# Altium project pca10112.PrjPCB (part 5 of 5)

## Sheet pca10112_sheet8_FEM.SchDoc: PCA10112 - Front End Module
size A3; Organization: Nordic Semiconductor; DocumentNumber: 8; Revision: 1.1.0; SheetNumber: 8; SheetTotal: 8; Author: HANY; CompanyName: Nordic Semiconductor; DrawnBy: HANY; ProjectName: pca10112.PrjPCB
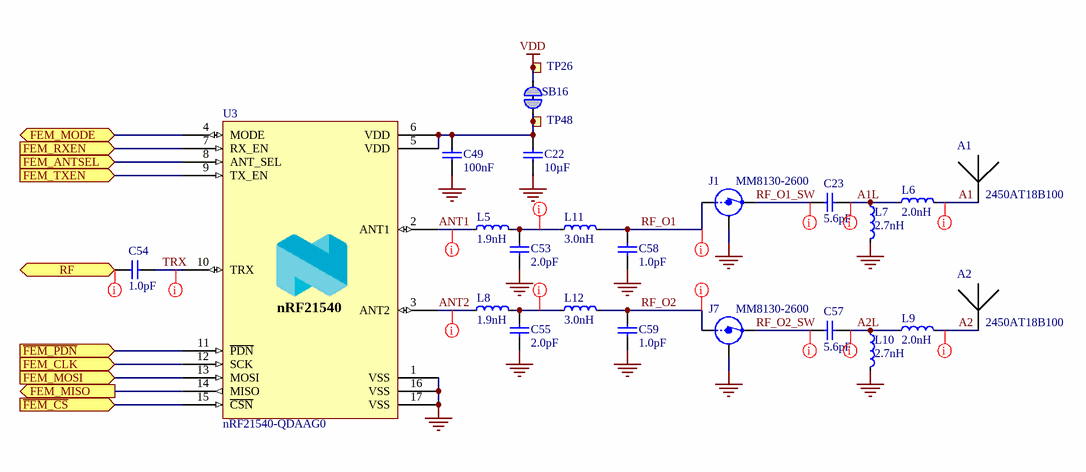
[diagram p7: pca10112_sheet8_FEM.SchDoc]

### Parts
A1  2450AT18B100  [2450AT18B100]
A2  2450AT18B100  [2450AT18B100]
C22  10µF  [CAPC1608X06L]
C23  5.6pF  [CAPC0603X03L_C]
C49  100nF  [CAPC0603X03L_C]
C53  2.0pF  [CAPC0603X03L_C]
C54  1.0pF  [CAPC0603X03L_C]
C55  2.0pF  [CAPC0603X03L_C]
C57  5.6pF  [CAPC0603X03L_C]
C58  1.0pF  [CAPC0603X03L_C]
C59  1.0pF  [CAPC0603X03L_C]
J1  MM8130-2600  [COAXIAL-SWF]
J7  MM8130-2600  [COAXIAL-SWF]
L5  1.9nH  [INDC0603X03L_C]
L6  2.0nH  [INDC0603X03L_C]
L7  2.7nH  [INDC0603X03L_C]
L8  1.9nH  [INDC0603X03L_C]
L9  2.0nH  [INDC0603X03L_C]
L10  2.7nH  [INDC0603X03L_C]
L11  3.0nH  [INDC0603X03L_C]
L12  3.0nH  [INDC0603X03L_C]
SB16  Solderbridge  [Solderbridge_Shorted]  (value not drawn)  (net tie, no BOM)
TP26  Ø1.0mm,SMD  [TP_SMD_Ø1.0mm]  (value not drawn)  (no BOM)
TP48  Ø1.0mm,SMD  [TP_SMD_Ø1.0mm]  (value not drawn)  (no BOM)
U3  nRF21540-QDAAG0  [QFN65P400X400X65_HS-17N]

### Ports
FEM_ANTSEL (in), FEM_CLK (in), FEM_MISO (out), FEM_MODE (bidir), FEM_MOSI (in), FEM_RXEN (in), FEM_TXEN (in), RF (bidir), ~{FEM_CS} (in), ~{FEM_PDN} (in)

### Nets
GND: C22.1 C49.1 C53.1 C55.1 C58.1 C59.1 J1.2(Shield) J7.2(Shield) L7.2 L10.2 U3.1(VSS) U3.16(VSS) U3.17(VSS)
VDD: SB16.1 TP26.1
A1: A1.1 L6.2
A1L: C23.1 L6.1 L7.1
A2: A2.1 L9.2
A2L: C57.1 L9.1 L10.1
ANT1: L5.1 U3.2(ANT1)
ANT2: L8.1 U3.3(ANT2)
P0.17: U3.4(MODE) ; port FEM_MODE
P0.19: U3.7(RX_EN) ; port FEM_RXEN
P0.20: U3.8(ANT_SEL) ; port FEM_ANTSEL
P0.21: U3.15(~{CSN}) ; port ~{FEM_CS}
P0.22: U3.9(TX_EN) ; port FEM_TXEN
P0.23: U3.11(~{PDN}) ; port ~{FEM_PDN}
P1.13: U3.13(MOSI) ; port FEM_MOSI
P1.14: U3.14(MISO) ; port FEM_MISO
P1.15: U3.12(SCK) ; port FEM_CLK
RF: C54.1 ; port RF
RF_O1: C58.2 J1.1(IN) L11.2
RF_O1_SW: C23.2 J1.3(OUT)
RF_O2: C59.2 J7.1(IN) L12.2
RF_O2_SW: C57.2 J7.3(OUT)
TRX: C54.2 U3.10(TRX)
NetC22_2: C22.2 C49.2 SB16.2 TP48.1 U3.5(VDD) U3.6(VDD)
NetC53_2: C53.2 L5.2 L11.1
NetC55_2: C55.2 L8.2 L12.1

### Layout directives
net class Ant: A1, A1L, A2, A2L, ANT1, ANT2, NetC53_2, NetC55_2, RF, RF_O1, RF_O1_SW, RF_O2, RF_O2_SW, TRX

### Notes on the sheet
- Size
- Date:
- A3
- Project Number
- Sheet         of
- Revision
- File:
- Drawn By:
- (in symbol nRF21540-QDAAG0) nRF21540

### Library data of the parts
A1 A2 = Johanson 2450AT18B100: 2.45 GHz chip antenna; Manufacturer: Johanson Technology; Part number IPS: 00000007781; Note: N.A.; Pad Count: 2; Part Number: Johanson 2450AT18B100; Manufacturer Part Number: 2450AT18B100; Footprint Doc: 2450AT18B100; LatestRevisionDate: 2013-09-13; Pin Count: 2; Publisher: Nordic Semiconductor; Published: 2013-09-13; Value: 2450AT18B100; Artikkelnr Noca: N.A.; ComponentLink1URL: N.A.; ComponentLink1Description: Datasheet; ComponentLink2URL: N.A.; ComponentLink2Description: Supplier link; HelpURL: http://www.johansontechnology.com/datasheets/antennas/2450AT18B100.pdf; Supplier 1: Digi-Key; Supplier Part Number 1: 712-1006-1-ND; Supplier 2: N.A.; Supplier Part Number 2: N.A.; Component Class: Antennas; PartId: 100700001; Author: rsk; Part number Norautron: N.A.
C22 = C0603-10µ: Capacitor, X5R, ±20%; Manufacturer: N.A.; Part number IPS: 00000007785; Note: 6.3V; Artikkelnr Noca: 20039234; Pad Count: 2; Part Number: C0603-10µ; Manufacturer Part Number: N.A.; ComponentLink1URL: N.A.; ComponentLink1Description: Datasheet; ComponentLink2URL: N.A.; ComponentLink2Description: Supplier link; HelpURL: N.A.; Footprint Doc: 0603; LatestRevisionDate: 2011-01-17; Pin Count: 2; Publisher: Nordic Semiconductor; Published: 2011-01-17; Value: 10µF; Supplier 1: N.A.; Supplier Part Number 1: N.A.; Supplier 2: N.A.; Supplier Part Number 2: N.A.; Component Class: Capacitors; PartId: 100200275; Author: rsk; Part number Norautron: N.A.
C23 C57 = C0201-5.6p: Chip Cap 0201; Manufacturer: N.A.; Part number IPS: 00000004899; Note: Chip Cap 1%; Pad Count: 2; Part Number: C0201-5.6p; Manufacturer Part Number: N.A.; LatestRevisionDate: 2020-10-13; Pin Count: 2; Publisher: Nordic Semiconductor; Published: 2014-11-13; Value: 5.6pF; Artikkelnr Noca: N.A.; Footprint Doc: 0201; ComponentLink1URL: N.A.; ComponentLink1Description: Datasheet; ComponentLink2URL: N.A.; ComponentLink2Description: Supplier link; HelpURL: N.A.; Supplier 1: N.A.; Supplier Part Number 1: N.A.; Supplier 2: N.A.; Supplier Part Number 2: N.A.; Component Class: Capacitors; PartId: 100200028; Author: rsk; Part number Norautron: N.A.
C49 = C0201-100n: Capacitor, X5R, ±10%; Manufacturer: N.A.; Part number IPS: 00000001248, 00000002505; Note: 16V; Pad Count: 2; Part Number: C0201-100n; Manufacturer Part Number: N.A.; ComponentLink1URL: N.A.; ComponentLink1Description: Datasheet; ComponentLink2URL: N.A.; ComponentLink2Description: Supplier link; HelpURL: N.A.; Footprint Doc: 0201; LatestRevisionDate: 2017-11-09; Pin Count: 2; Publisher: Nordic Semiconductor; Published: 2014-11-13; Value: 100nF; Artikkelnr Noca: N.A.; Supplier 1: N.A.; Supplier Part Number 1: N.A.; Supplier 2: N.A.; Supplier Part Number 2: N.A.; Component Class: Capacitors; PartId: 100200078; Author: rsk; Part number Norautron: N.A.
C53 C55 = C0201-2.0p-HQ-Murata: Capacitor, NP0, ±0.05pF, 25V; Manufacturer: Murata; Manufacturer Part Number: GJM0335C1E2R0WB01; Part number IPS: 00000001775; Artikkelnr Noca: N.A.; Pad Count: 2; Part Number: C0201-2.0p-HQ-Murata; ComponentLink1URL: N.A.; ComponentLink1Description: Datasheet; ComponentLink2URL: N.A.; ComponentLink2Description: Supplier link; HelpURL: https://psearch.en.murata.com/capacitor/product/GJM0335C1E2R0WB01%23.html; Footprint Doc: 0201; LatestRevisionDate: 2018-10-25; Published: 2018-10-25; Value: 2.0pF; Note: 25V; Supplier 1: N.A.; Supplier Part Number 1: N.A.; Supplier 2: N.A.; Supplier Part Number 2: N.A.; Component Class: Capacitors; PartId: 100200419; Author: rsk; Part number Norautron: N.A.
C54 = C0201-1p0: CAP CER 1PF 25V C0G/NP0 0201; Manufacturer: Murata; Manufacturer Part Number: GJM0335C1E1R0BB01D; Part number IPS: 00000007964; Note: ±0.1pF; Artikkelnr Noca: N.A.; Pad Count: 2; Part Number: C0201-1p0; ComponentLink1URL: N.A.; ComponentLink1Description: Datasheet; ComponentLink2Description: Supplier link; HelpURL: http://search.murata.co.jp/Ceramy/image/img/A01X/G101/ENG/GJM0335C1E1R0BB01-01.pdf; Footprint Doc: 0201; LatestRevisionDate: 2020-10-13; Pin Count: 2; Publisher: Nordic Semiconductor; Published: 2017-09-21; Value: 1.0pF; ComponentLink2URL: N.A.; Supplier 1: Digi-Key; Supplier Part Number 1: 490-11172-1-ND; Supplier 2: N.A.; Supplier Part Number 2: N.A.; Component Class: Capacitors; PartId: 100200398; Author: rsk; Part number Norautron: N.A.
C58 C59 = C0201-1.0p_RF: RF Chip Cap 0201; Manufacturer: N.A.; Note: High frequency chip capasitors ±5%, NP0; Pad Count: 2; Part Number: C0201-1.0p_RF; Manufacturer Part Number: N.A.; ComponentLink1URL: N.A.; ComponentLink1Description: Datasheet; ComponentLink2URL: N.A.; ComponentLink2Description: Supplier link; HelpURL: N.A.; Footprint Doc: 0201; LatestRevisionDate: 2016-04-22; Published: 2016-04-22; Value: 1.0pF; Artikkelnr Noca: N.A.; Part number IPS: N.A.; Supplier 1: N.A.; Supplier Part Number 1: N.A.; Supplier 2: N.A.; Supplier Part Number 2: N.A.; Component Class: Capacitors; PartId: 100200085; Author: rsk; Part number Norautron: N.A.
J1 J7 = MM8130-2600: Coaxial Connector with Switch; Manufacturer: Murata; Part number IPS: 00000009955; Note: N.A.; Artikkelnr Noca: 55029011; Pad Count: 3; Part Number: MM8130-2600; Manufacturer Part Number: MM8130-2600; LatestRevisionDate: 2014-04-24; Pin Count: 3; Publisher: Nordic Semiconductor; Published: 2014-04-24; Value: MM8130-2600; Footprint Doc: COAXIAL-SWF; ComponentLink1URL: N.A.; ComponentLink1Description: Datasheet; ComponentLink2URL: N.A.; ComponentLink2Description: Supplier link; HelpURL: http://www.murata.com/products/catalog/pdf/o33e.pdf; Supplier 1: Digi-Key; Supplier Part Number 1: 490-4981-1-ND; Supplier 2: Mouser; Supplier Part Number 2: 81-MM8130-2600RA2; Component Class: Connectors; PartId: 100500400; Author: rsk; Part number Norautron: N.A.
L5 L8 = L0201-1n9-HQ-Murata: Inductor, 600mA, ±0.1ｎH, 120mOhm; Manufacturer: Murata; Manufacturer Part Number: LQP03HQ1N9B02; Part number IPS: 00000004903; Note: -55°C ~ 125°C; Artikkelnr Noca: N.A.; Pad Count: 2; Part Number: L0201-1n9-HQ-Murata; ComponentLink1URL: https://search.murata.co.jp/Ceramy/image/img/P02/JELF243C-0021.pdf; ComponentLink1Description: Datasheet; ComponentLink2Description: Supplier link; HelpURL: https://psearch.en.murata.com/inductor/product/LQP03HQ1N9B02%23.html; Footprint Doc: 0201; LatestRevisionDate: 2018-10-23; Pin Count: 2; Publisher: Nordic Semiconductor; Published: 2018-10-23; Value: 1.9nH; ComponentLink2URL: N.A.; Supplier 1: Digi-Key; Supplier Part Number 1: 490-13889-1-ND; Supplier 2: N.A.; Supplier Part Number 2: N.A.; Component Class: Inductors; PartId: 100300206; Author: rsk; Part number Norautron: N.A.
L6 L9 = L0201-2n0-HQ-Murata: Inductor, 600mA, ±0.1ｎH, 120mOhm; Manufacturer: Murata; Manufacturer Part Number: LQP03HQ2N0B02; Part number IPS: 00000001670; Note: -55°C ~ 125°C; Artikkelnr Noca: N.A.; Pad Count: 2; Part Number: L0201-2n0-HQ-Murata; LatestRevisionDate: 2018-10-23; Pin Count: 2; Publisher: Nordic Semiconductor; Published: 2018-10-23; Value: 2.0nH; Footprint Doc: 0201; ComponentLink1Description: Datasheet; ComponentLink2Description: Supplier link; ComponentLink1URL: https://search.murata.co.jp/Ceramy/image/img/P02/JELF243C-0021.pdf; HelpURL: https://psearch.en.murata.com/inductor/product/LQP03HQ2N0B02%23.html; ComponentLink2URL: N.A.; Supplier 1: Digi-Key; Supplier Part Number 1: 490-13895-1-ND; Supplier 2: N.A.; Supplier Part Number 2: N.A.; Component Class: Inductors; PartId: 100300207; Author: rsk; Part number Norautron: N.A.
L7 L10 = L0201-2n7-HQ-Murata: Inductor, 600mA, ±0.1ｎH, 120mOhm; Manufacturer: Murata; Manufacturer Part Number: LQP03HQ2N7B02; Part number IPS: 00000001753; Note: -55°C ~ 125°C; Artikkelnr Noca: N.A.; Pad Count: 2; Part Number: L0201-2n7-HQ-Murata; LatestRevisionDate: 2018-10-23; Pin Count: 2; Publisher: Nordic Semiconductor; Published: 2018-10-23; Value: 2.7nH; Footprint Doc: 0201; ComponentLink1Description: Datasheet; ComponentLink2Description: Supplier link; ComponentLink1URL: https://search.murata.co.jp/Ceramy/image/img/P02/JELF243C-0021.pdf; HelpURL: https://psearch.en.murata.com/inductor/product/LQP03HQ2N7B02%23.html; ComponentLink2URL: N.A.; Supplier 1: Digi-Key; Supplier Part Number 1: 490-13909-1-ND; Supplier 2: N.A.; Supplier Part Number 2: N.A.; Component Class: Inductors; PartId: 100300214; Author: rsk; Part number Norautron: N.A.
L11 L12 = L0201-3n0-HQ-Murata: Inductor, 600mA, ±0.1ｎH, 120mOhm; Manufacturer: Murata; Manufacturer Part Number: LQP03HQ3N0B02; Note: -55°C ~ 125°C; Artikkelnr Noca: N.A.; Pad Count: 2; Part Number: L0201-3n0-HQ-Murata; ComponentLink1URL: https://search.murata.co.jp/Ceramy/image/img/P02/JELF243C-0021.pdf; ComponentLink1Description: Datasheet; ComponentLink2Description: Supplier link; HelpURL: https://psearch.en.murata.com/inductor/product/LQP03HQ3N0B02%23.html; Footprint Doc: 0201; LatestRevisionDate: 2018-10-23; Published: 2018-10-23; Value: 3.0nH; Part number IPS: N.A.; ComponentLink2URL: N.A.; Supplier 1: Digi-Key; Supplier Part Number 1: 490-13915-1-ND; Supplier 2: N.A.; Supplier Part Number 2: N.A.; Component Class: Inductors; PartId: 100300217; Author: rsk; Part number Norautron: N.A.
SB16 = Solderbridge Shorted: Shorted Solderbridge; Manufacturer: N.A.; Pad Count: 2; Part Number: Solderbridge Shorted; Manufacturer Part Number: N.A.; LatestRevisionDate: 2012-08-07; Pin Count: 2; Publisher: Nordic Semiconductor; Published: 2012-08-07; Value: Solderbridge; Note: N.A.; Artikkelnr Noca: N.A.; Footprint Doc: Solderbridge_Shorted; Part number IPS: N.A.; ComponentLink1URL: N.A.; ComponentLink1Description: Datasheet; ComponentLink2URL: N.A.; ComponentLink2Description: Supplier link; HelpURL: N.A.; Supplier 1: N.A.; Supplier Part Number 1: N.A.; Supplier 2: N.A.; Supplier Part Number 2: N.A.; Component Class: Connectors; PartId: 100500459; Author: rsk; Part number Norautron: N.A.
TP26 TP48 = TP_SMD_Ø1.0MM: 1.0mm circular SMD testpad; Manufacturer: Nordic Semiconductor; Manufacturer Part Number: N.A.; Pad Count: 1; Part Number: TP_SMD_Ø1.0MM; LatestRevisionDate: 2021-03-05; Pin Count: 1; Publisher: Nordic Semiconductor; Published: 2013-06-11; Value: Ø1.0mm,SMD; Note: N.A.; Artikkelnr Noca: N.A.; Footprint Doc: TP_SMD_Ø1.0mm; Part number IPS: N.A.; ComponentLink1URL: N.A.; ComponentLink1Description: Datasheet; ComponentLink2URL: N.A.; ComponentLink2Description: Supplier link; HelpURL: N.A.; Supplier 1: N.A.; Supplier Part Number 1: N.A.; Supplier 2: N.A.; Supplier Part Number 2: N.A.; Component Class: Connectors; PartId: 100500475; Author: rsk; Part number Norautron: N.A.
U3 = nRF21540-QDAAG0: Radio front-end / range extender for 2.4GHz; Manufacturer: Nordic Semiconductor; Artikkelnr Noca: N.A.; Pad Count: 16; Author: hany; Component Class: nRF_Devices; ComponentLink1Description: Datasheet; ComponentLink1URL: N.A.; ComponentLink2Description: Supplier link; ComponentLink2URL: N.A.; Footprint Doc: QFN-16; HelpURL: N.A.; LatestRevisionDate: 2021-03-24; Manufacturer Part Number: nRF21540-QDAAG0; Note: N.A.; Part number IPS: N.A.; Part number Norautron: N.A.; Published: 2021-03-24; Supplier 1: Nordic Semiconductor; Supplier 2: N.A.; Supplier Part Number 1: nRF21540-QDAAG0; Supplier Part Number 2: N.A.; Value: nRF21540-QDAAG0; Part Number: nRF21540-QDAAG0

## Nets that join several sheets
GND: pca10112_sheet2_nrf52840_mcu (27 pins), pca10112_sheet3_pin_map (C51.1 C52.2), pca10112_sheet4_interface_mcu (37 pins), pca10112_sheet5_misc (22 pins), pca10112_sheet6_connectors (85 pins), pca10112_sheet7_power_supply (44 pins), pca10112_sheet8_FEM (13 pins)
V5V: pca10112_sheet6_connectors (5 pins), pca10112_sheet7_power_supply (12 pins)
VBUS: pca10112_sheet5_misc (Q40.2 R40.1), pca10112_sheet6_connectors (C69.2 FB61.2 J4.5), pca10112_sheet7_power_supply (D80.2)
VBUS_nRF: pca10112_sheet2_nrf52840_mcu (C21.1 U1.AD2), pca10112_sheet7_power_supply (R98.2)
VBUS_nRF': pca10112_sheet6_connectors (C68.2 FB60.2), pca10112_sheet7_power_supply (5 pins)
VDD: pca10112_sheet5_misc (18 pins), pca10112_sheet6_connectors (R68.2 SB47.1 SB59.2), pca10112_sheet7_power_supply (8 pins), pca10112_sheet8_FEM (SB16.1 TP26.1)
VDD_HV: pca10112_sheet2_nrf52840_mcu (C19.1 U1.Y2), pca10112_sheet6_connectors (P20.10 P26.10), pca10112_sheet7_power_supply (P23.1 R91.2 SB41.1 TP25.1)
VDD_HV': pca10112_sheet6_connectors (P20.11 P26.11), pca10112_sheet7_power_supply (5 pins)
VDD_nRF: pca10112_sheet2_nrf52840_mcu (11 pins), pca10112_sheet6_connectors (P20.1 P26.1), pca10112_sheet7_power_supply (5 pins)
VDD_nRF': pca10112_sheet6_connectors (P20.2 P26.2 SB60.2), pca10112_sheet7_power_supply (P22.2 R90.1 SB40.2 SW9.3)
VDD_SAM: pca10112_sheet4_interface_mcu (24 pins), pca10112_sheet6_connectors (J4.1 R64.2 R65.2 R66.2), pca10112_sheet7_power_supply (SB37.1 TP35.1 U18.A1)
VDD_UTMI: pca10112_sheet4_interface_mcu (C28.2 SB49.2 U2.79), pca10112_sheet7_power_supply (SB48.1 U24.A1)
VIN3-5V: pca10112_sheet6_connectors (P20.9 P26.9), pca10112_sheet7_power_supply (D83.2)
VIO: pca10112_sheet6_connectors (9 pins), pca10112_sheet7_power_supply (SB38.1)
VIO_REF: pca10112_sheet6_connectors (P20.12 P26.12), pca10112_sheet7_power_supply (R99.2)
VLi-Ion: pca10112_sheet6_connectors (J6.2 P27.2 TP31.1), pca10112_sheet7_power_supply (D82.2 SW9.5)
D20: pca10112_sheet5_misc (R43.1), pca10112_sheet6_connectors (P6.7 P12.7 P17.14)
D21: pca10112_sheet5_misc (R45.1), pca10112_sheet6_connectors (P6.8 P12.8 P17.16)
D_N: pca10112_sheet2_nrf52840_mcu (U1.AD4), pca10112_sheet6_connectors (D60.2 J3.2 TP13.1)
D_P: pca10112_sheet2_nrf52840_mcu (U1.AD6), pca10112_sheet6_connectors (D60.3 J3.3 TP14.1)
DFSD_N: pca10112_sheet4_interface_mcu (U2.80), pca10112_sheet6_connectors (R60.1)
DFSD_P: pca10112_sheet4_interface_mcu (U2.81), pca10112_sheet6_connectors (R61.1)
DHSD_N: pca10112_sheet4_interface_mcu (U2.77), pca10112_sheet6_connectors (D61.2 J2.2 R60.2 TP10.1)
DHSD_P: pca10112_sheet4_interface_mcu (U2.76), pca10112_sheet6_connectors (D61.3 J2.3 R61.2 TP9.1)
EXT_GND_DETECT: pca10112_sheet4_interface_mcu (U2.67), pca10112_sheet6_connectors (P19.9)
EXT_RESET: pca10112_sheet4_interface_mcu (U2.68), pca10112_sheet6_connectors (P19.10)
EXT_SWDCLK: pca10112_sheet4_interface_mcu (U2.70), pca10112_sheet6_connectors (P19.4)
EXT_SWDIO: pca10112_sheet4_interface_mcu (U2.71), pca10112_sheet6_connectors (P19.2)
EXT_SWO: pca10112_sheet4_interface_mcu (U2.18), pca10112_sheet6_connectors (P19.6)
EXT_VTG: pca10112_sheet4_interface_mcu (Q21.4 R24.1), pca10112_sheet6_connectors (P19.1 SB47.2)
~{IF_OFF}: pca10112_sheet4_interface_mcu (Q20.2 Q21.2 U2.90), pca10112_sheet5_misc (6 pins), pca10112_sheet7_power_supply (U18.B2 U24.B2)
IMCU_BOOT: pca10112_sheet4_interface_mcu (SB65.1 U2.24), pca10112_sheet5_misc (SB46.2 U7.15)
IMCU_CTS: pca10112_sheet4_interface_mcu (U2.38), pca10112_sheet5_misc (TP1.1 U5.3)
IMCU_RESET: pca10112_sheet4_interface_mcu (U2.57), pca10112_sheet6_connectors (J4.10 R66.1)
IMCU_RTS: pca10112_sheet4_interface_mcu (U2.39), pca10112_sheet5_misc (TP3.1 U5.15)
IMCU_RxD: pca10112_sheet4_interface_mcu (U2.40), pca10112_sheet5_misc (TP2.1 U5.11)
IMCU_TCKS: pca10112_sheet4_interface_mcu (U2.56), pca10112_sheet6_connectors (J4.4 R65.1)
IMCU_TDIS: pca10112_sheet4_interface_mcu (U2.51), pca10112_sheet6_connectors (J4.8 R67.1)
IMCU_TDOS: pca10112_sheet4_interface_mcu (U2.54), pca10112_sheet6_connectors (J4.6)
IMCU_TMSS: pca10112_sheet4_interface_mcu (U2.55), pca10112_sheet6_connectors (J4.2 R64.1)
IMCU_TxD: pca10112_sheet4_interface_mcu (U2.41), pca10112_sheet5_misc (TP4.1 U5.7)
NFC1: pca10112_sheet5_misc (C46.1 R44.1), pca10112_sheet6_connectors (J5.2 TP17.1)
NFC2: pca10112_sheet5_misc (C47.2 R46.1), pca10112_sheet6_connectors (J5.4 TP18.1)
OB_RESET: pca10112_sheet4_interface_mcu (U2.27), pca10112_sheet5_misc (TP7.1 U6.7)
OB_SWDCLK: pca10112_sheet4_interface_mcu (R28.2 U2.5), pca10112_sheet5_misc (TP6.1 U6.3)
OB_SWDIO: pca10112_sheet4_interface_mcu (R29.2 U2.12), pca10112_sheet5_misc (TP5.1 U6.15)
OB_SWO: pca10112_sheet4_interface_mcu (U2.20), pca10112_sheet5_misc (TP8.1 U6.11)
P0.02/AIN0: pca10112_sheet2_nrf52840_mcu (U1.A12), pca10112_sheet6_connectors (P4.8 P10.8 P16.16)
P0.03/AIN1: pca10112_sheet2_nrf52840_mcu (U1.B13), pca10112_sheet6_connectors (P2.1 P8.1 P14.2 TP42.1)
P0.04/AIN2: pca10112_sheet2_nrf52840_mcu (U1.J1), pca10112_sheet5_misc (U8.15), pca10112_sheet6_connectors (P2.2 P8.2 P14.4 TP43.1)
P0.05/AIN3: pca10112_sheet2_nrf52840_mcu (U1.K2), pca10112_sheet5_misc (SB51.1), pca10112_sheet6_connectors (P6.3 P12.3 P17.6)
P0.06: pca10112_sheet2_nrf52840_mcu (U1.L1), pca10112_sheet5_misc (SB53.1), pca10112_sheet6_connectors (P6.4 P12.4 P17.8)
P0.07: pca10112_sheet2_nrf52840_mcu (U1.M2), pca10112_sheet5_misc (U8.1), pca10112_sheet6_connectors (P6.5 P12.5 P17.10 P25.12)
P0.08: pca10112_sheet2_nrf52840_mcu (U1.N1), pca10112_sheet5_misc (SB52.1), pca10112_sheet6_connectors (P6.6 P12.6 P17.12)
P0.09/NFC1: pca10112_sheet2_nrf52840_mcu (U1.L24), pca10112_sheet5_misc (R43.2 R44.2)
P0.10/NFC2: pca10112_sheet2_nrf52840_mcu (U1.J24), pca10112_sheet5_misc (R45.2 R46.2)
P0.11: pca10112_sheet2_nrf52840_mcu (U1.T2), pca10112_sheet5_misc (U8.5), pca10112_sheet6_connectors (P24.1 P25.18)
P0.12: pca10112_sheet2_nrf52840_mcu (U1.U1), pca10112_sheet5_misc (U8.9), pca10112_sheet6_connectors (P24.2 P25.16)
P0.13: pca10112_sheet2_nrf52840_mcu (U1.AD8), pca10112_sheet5_misc (SB5.1), pca10112_sheet6_connectors (P24.3)
P0.14: pca10112_sheet2_nrf52840_mcu (U1.AC9), pca10112_sheet5_misc (SB6.1), pca10112_sheet6_connectors (P24.4)
P0.15: pca10112_sheet2_nrf52840_mcu (U1.AD10), pca10112_sheet5_misc (SB7.1), pca10112_sheet6_connectors (P24.5)
P0.16: pca10112_sheet2_nrf52840_mcu (U1.AC11), pca10112_sheet5_misc (SB8.1), pca10112_sheet6_connectors (P24.6)
P0.17: pca10112_sheet2_nrf52840_mcu (U1.AD12), pca10112_sheet6_connectors (P24.7), pca10112_sheet8_FEM (U3.4)
P0.18/RESET: pca10112_sheet2_nrf52840_mcu (U1.AC13), pca10112_sheet5_misc (SB42.2 SB44.2 SB45.2 SB56.1), pca10112_sheet6_connectors (P18.10 P24.8 P25.10)
P0.19: pca10112_sheet2_nrf52840_mcu (U1.AC15), pca10112_sheet6_connectors (P24.9), pca10112_sheet8_FEM (U3.7)
P0.20: pca10112_sheet2_nrf52840_mcu (U1.AD16), pca10112_sheet6_connectors (P24.10), pca10112_sheet8_FEM (U3.8)
P0.21: pca10112_sheet2_nrf52840_mcu (U1.AC17), pca10112_sheet6_connectors (P24.11), pca10112_sheet8_FEM (U3.15)
P0.22: pca10112_sheet2_nrf52840_mcu (U1.AD18), pca10112_sheet6_connectors (P24.12), pca10112_sheet8_FEM (U3.9)
P0.23: pca10112_sheet2_nrf52840_mcu (U1.AC19), pca10112_sheet6_connectors (P24.13), pca10112_sheet8_FEM (U3.11)
P0.24: pca10112_sheet2_nrf52840_mcu (U1.AD20), pca10112_sheet5_misc (SW3.2), pca10112_sheet6_connectors (P24.14)
P0.25: pca10112_sheet2_nrf52840_mcu (U1.AC21), pca10112_sheet5_misc (SW4.2), pca10112_sheet6_connectors (P24.15)
P0.26: pca10112_sheet2_nrf52840_mcu (U1.G1), pca10112_sheet3_pin_map (C51.2 R1.2)
P0.27: pca10112_sheet2_nrf52840_mcu (U1.H2), pca10112_sheet3_pin_map (C52.1 R2.2)
P0.28/AIN4: pca10112_sheet2_nrf52840_mcu (U1.B11), pca10112_sheet6_connectors (P2.3 P8.3 P14.6 TP44.1)
P0.29/AIN5: pca10112_sheet2_nrf52840_mcu (U1.A10), pca10112_sheet6_connectors (P2.4 P8.4 P14.8 TP45.1)
P0.30/AIN6: pca10112_sheet2_nrf52840_mcu (U1.B9), pca10112_sheet6_connectors (P2.5 P8.5 P14.10 TP46.1)
P0.31/AIN7: pca10112_sheet2_nrf52840_mcu (U1.A8), pca10112_sheet6_connectors (P2.6 P8.6 P14.12 TP47.1)
P1.00: pca10112_sheet2_nrf52840_mcu (U1.AD22), pca10112_sheet5_misc (SB57.1), pca10112_sheet6_connectors (P18.6 P24.16 P25.6 P25.14)
P1.01: pca10112_sheet2_nrf52840_mcu (U1.Y23), pca10112_sheet6_connectors (P3.1 P9.1 P15.2)
P1.02: pca10112_sheet2_nrf52840_mcu (U1.W24), pca10112_sheet6_connectors (P3.2 P9.2 P15.4)
P1.03: pca10112_sheet2_nrf52840_mcu (U1.V23), pca10112_sheet6_connectors (P3.3 P9.3 P15.6)
P1.04: pca10112_sheet2_nrf52840_mcu (U1.U24), pca10112_sheet6_connectors (P3.4 P9.4 P15.8)
P1.05: pca10112_sheet2_nrf52840_mcu (U1.T23), pca10112_sheet6_connectors (P3.5 P9.5 P15.10)
P1.06: pca10112_sheet2_nrf52840_mcu (U1.R24), pca10112_sheet6_connectors (P3.6 P9.6 P15.12)
P1.07: pca10112_sheet2_nrf52840_mcu (U1.P23), pca10112_sheet5_misc (U8.3), pca10112_sheet6_connectors (P3.7 P9.7 P15.14)
P1.08: pca10112_sheet2_nrf52840_mcu (U1.P2), pca10112_sheet5_misc (U8.7), pca10112_sheet6_connectors (P3.8 P9.8 P15.16)
P1.09: pca10112_sheet2_nrf52840_mcu (U1.R1), pca10112_sheet6_connectors (P24.17 P25.20)
P1.10: pca10112_sheet2_nrf52840_mcu (U1.A20), pca10112_sheet6_connectors (P4.1 P10.1 P16.2)
P1.11: pca10112_sheet2_nrf52840_mcu (U1.B19), pca10112_sheet6_connectors (P4.2 P10.2 P16.4)
P1.12: pca10112_sheet2_nrf52840_mcu (U1.B17), pca10112_sheet6_connectors (P4.3 P10.3 P16.6)
P1.13: pca10112_sheet2_nrf52840_mcu (U1.A16), pca10112_sheet6_connectors (5 pins), pca10112_sheet8_FEM (U3.13)
P1.14: pca10112_sheet2_nrf52840_mcu (U1.B15), pca10112_sheet6_connectors (5 pins), pca10112_sheet8_FEM (U3.14)
P1.15: pca10112_sheet2_nrf52840_mcu (U1.A14), pca10112_sheet6_connectors (5 pins), pca10112_sheet8_FEM (U3.12)
RESET_PIN: pca10112_sheet5_misc (SB43.2 SB44.1 U7.4), pca10112_sheet6_connectors (5 pins)
RF: pca10112_sheet2_nrf52840_mcu (C4.2 C56.1 L1.2), pca10112_sheet8_FEM (C54.1)
SCL: pca10112_sheet3_pin_map (R2.1), pca10112_sheet5_misc (U7.12), pca10112_sheet6_connectors (P4.10 P10.10 P16.20)
SDA: pca10112_sheet3_pin_map (R1.1), pca10112_sheet5_misc (U7.8), pca10112_sheet6_connectors (P4.9 P10.9 P16.18)
SH_GND_DETECT: pca10112_sheet4_interface_mcu (U2.62), pca10112_sheet6_connectors (P20.8 P26.8)
SH_RESET: pca10112_sheet4_interface_mcu (U2.63), pca10112_sheet6_connectors (P20.7 P26.7)
SH_SWDCLK: pca10112_sheet4_interface_mcu (U2.65), pca10112_sheet6_connectors (P20.5 P26.5)
SH_SWDIO: pca10112_sheet4_interface_mcu (U2.66), pca10112_sheet6_connectors (P20.4 P26.4)
SH_SWO: pca10112_sheet4_interface_mcu (U2.21), pca10112_sheet6_connectors (P20.6 P26.6)
SH_VTG: pca10112_sheet4_interface_mcu (Q20.4 R22.1), pca10112_sheet6_connectors (P20.3 P26.3)
SHIELD_DETECT: pca10112_sheet5_misc (U7.10), pca10112_sheet6_connectors (R68.1 SB33.2 TP19.1)
SWDCLK: pca10112_sheet2_nrf52840_mcu (U1.AA24), pca10112_sheet5_misc (SB55.1), pca10112_sheet6_connectors (P18.4 P25.4)
SWDIO: pca10112_sheet2_nrf52840_mcu (U1.AC24), pca10112_sheet5_misc (SB54.1), pca10112_sheet6_connectors (P18.2 P25.2)

## Assembly variants
Default Variant: not fitted Bat1 C10 C13 C22 C51 C52 C56 C56 C56 FB64 FB65 J4 P7 P8 P9 P10 P11 P12 P13 P14 P15 P16 P17 P25 P26 P27 P28 Q84 R43 R45 R54 R90 R91 R95 R96 Sh1 Sh2 Sh3 Sh4 Sh5 Sh6 U14 U21 U26